# Altium schematic sheet AD835ARZ.schdoc
size 54 x 38 mm
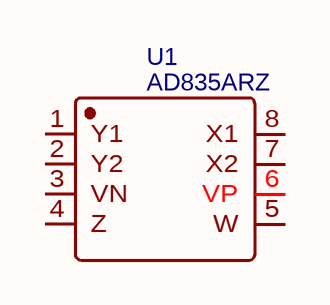
[diagram p0: AD835ARZ.schdoc]

## Parts
U1  AD835ARZ  [SOIC-8_L4.9-W3.9-P1.27-LS6.0-TL]

## Nets

Not connected (* = marked no-connect by the designer): U1 1(Y1) 2(Y2) 3(VN) 4(Z) 5(W) 6(VP) 7(X2) 8(X1)

## Library data of the parts
U1 = AD835ARZ: BOM_Manufacturer: ADI; spicePre: X; BOM_Supplier: LCSC; BOM_Manufacturer Part: AD835ARZ; BOM_Supplier Part: C26332; BOM_JLCPCB Part Class: Extended Part; spiceSymbolName: AD835ARZ